# EAGLE design XBee FX I2C Interface v1.4 (EAGLE 6.4)
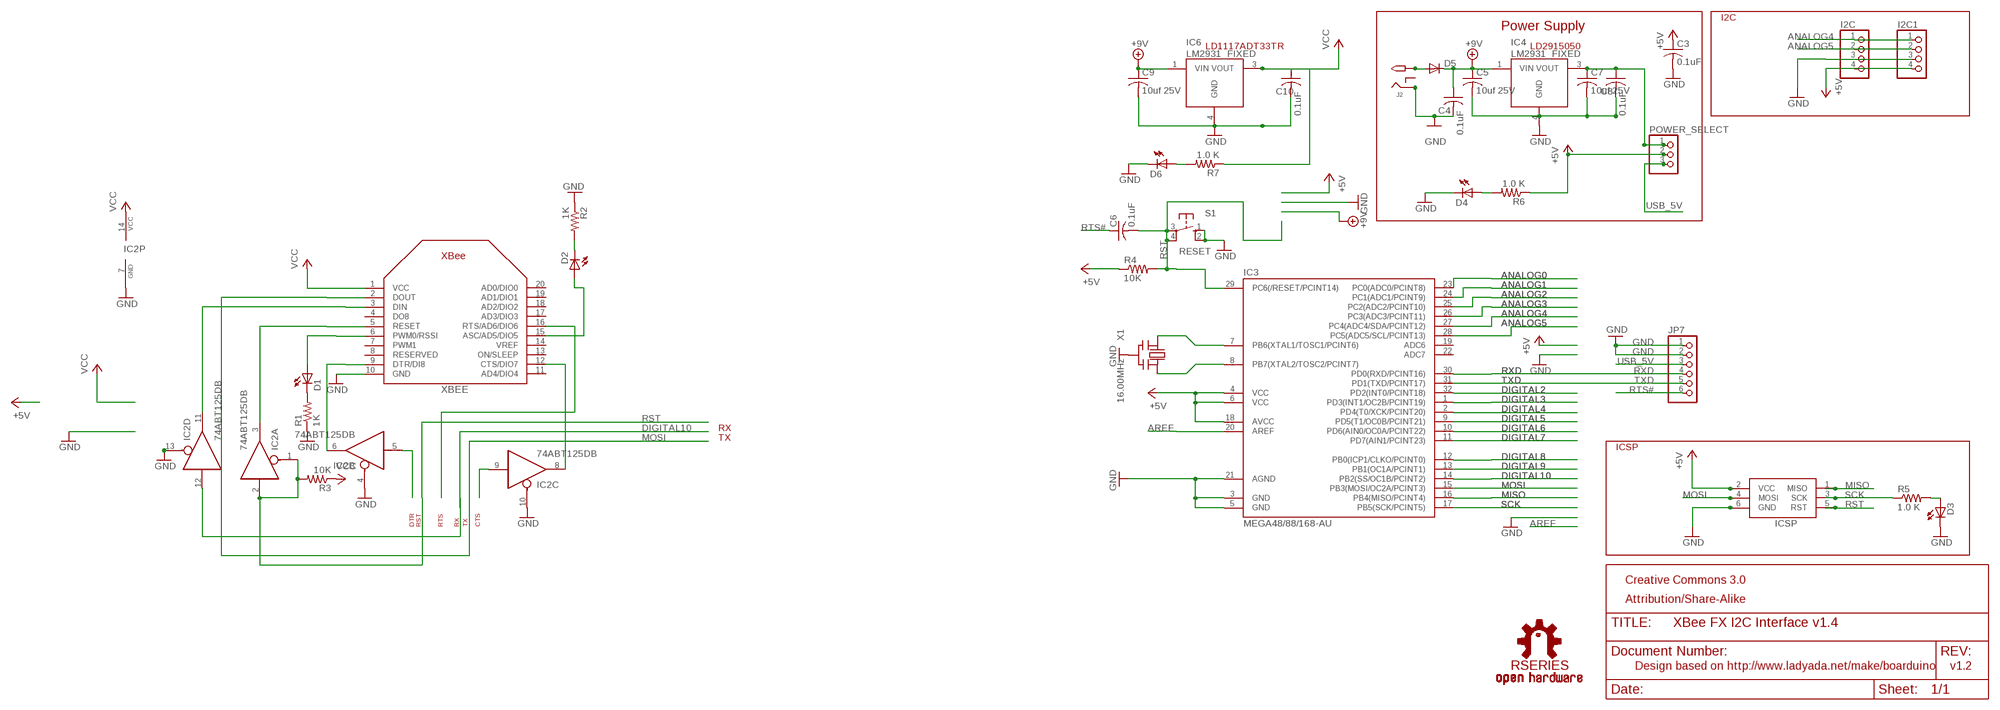
[diagram p0: schematic, sheet 1]

## Parts
C3  0.1uF  C-USC1206K  [C1206K]
C4  0.1uF  C-USC1206K  [C1206K]
C5  10uf 25V  C-USC1206K  [C1206K]
C6  0.1uF  C-USC1206K  [C1206K]
C7  10uf 25V  C-USC1206K  [C1206K]
C8  0.1uF  C-USC1206K  [C1206K]
C9  10uf 25V  C-USC1206K  [C1206K]
C10  0.1uF  C-USC1206K  [C1206K]
D1  LEDCHIPLED_1206  [CHIPLED_1206]
D2  LEDCHIPLED_1206  [CHIPLED_1206]
D3  RED  LEDCHIPLED_1206  [CHIPLED_1206]
D4  LEDCHIPLED_1206  [CHIPLED_1206]
D5  DIODE-SMB  [SMB]
D6  LEDCHIPLED_1206  [CHIPLED_1206]
I2C  PINHD-1X4CB  [1X04-CB]
I2C1  PINHD-1X4CB  [1X04-CB]
IC2  74ABT125DB  [SSOP14]
IC3  MEGA48/88/168-AU  [TQFP32-08]
IC4  LM2931_FIXED  [DPAK]
IC6  LM2931_FIXED  [DPAK]
ICSP  AVRISP-6  [AVRISP]
J2  2.1MMJACK  [PJ-102A]
JP7  PINHD-1X6CLEAN  [1X06-CLEAN]
POWER_SELECT  PINHD-1X3  [1X03]
R1  1K  R-US_R1206  [R1206]
R2  1K  R-US_R1206  [R1206]
R3  10K  R-US_R1206  [R1206]
R4  10K  R-US_R1206  [R1206]
R5  1.0 K  R-US_M1206  [M1206]
R6  1.0 K  R-US_M1206  [M1206]
R7  1.0 K  R-US_M1206  [M1206]
S1  RESET  10-XX  [B3F-10XX]
U$6  RSERIES-OSHW-LOGOMEDIUM  [RSERIES-OSHW-LOGO-MEDIUM]
X1  16.00MHz  CERMOSCILL  [CERM_OSC]
XBEE  XBEE  [XBEE]

## Nets
+5V [supply]: C3.1 I2C1.4 I2C.4 IC3.4(VCC) IC3.6(VCC) IC3.18(AVCC) ICSP.2(VCC) POWER_SELECT.2 R4.1 R6.1
+9V [supply]: C4.1 C5.1 C9.1 D5.C IC4.1(VIN) IC6.1(VIN)
ANALOG0: IC3.23(PC0(ADC0/PCINT8))
ANALOG1: IC3.24(PC1(ADC1/PCINT9))
ANALOG2: IC3.25(PC2(ADC2/PCINT10))
ANALOG3: IC3.26(PC3(ADC3/PCINT11))
ANALOG4: I2C1.1 I2C.1 IC3.27(PC4(ADC4/SDA/PCINT12))
ANALOG5: I2C1.2 I2C.2 IC3.28(PC5(ADC5/SCL/PCINT13))
AREF: IC3.20(AREF)
DIGITAL2: IC3.32(PD2(INT0/PCINT18))
DIGITAL3: IC3.1(PD3(INT1/OC2B/PCINT19))
DIGITAL4: IC3.2(PD4(T0/XCK/PCINT20))
DIGITAL5: IC3.9(PD5(T1/OC0B/PCINT21))
DIGITAL6: IC3.10(PD6(AIN0/OC0A/PCINT22))
DIGITAL7: IC3.11(PD7(AIN1/PCINT23))
DIGITAL8: IC3.12(PB0(ICP1/CLKO/PCINT0))
DIGITAL9: IC3.13(PB1(OC1A/PCINT1))
DIGITAL10: IC2.12(D:I) IC3.14(PB2(SS/OC1B/PCINT2))
GND [GND]: C3.2 C4.2 C9.2 C10.2 D3.C D4.C D6.C I2C1.3 I2C.3 IC2.4(B:OE) IC2.7(P:GND) IC2.10(C:OE) IC2.13(D:OE) IC3.3(GND) IC3.5(GND) IC3.21(AGND) IC4.4(GND) IC6.4(GND) ICSP.6(GND) J2.RING JP7.1 JP7.2 R1.1 R2.1 S1.1(S) S1.2(S1) X1.P$2(GND) XBEE.10(GND)
MISO: IC3.16(PB4(MISO/PCINT4)) ICSP.1(MISO)
MOSI: IC3.15(PB3(MOSI/OC2A/PCINT3)) ICSP.4(MOSI) XBEE.2(DOUT)
N$2: IC2.11(D:O) XBEE.3(DIN)
N$3: IC2.5(B:I)
N$5: D2.C R2.2
N$6: D6.A R7.2
N$7: D1.A XBEE.6(PWM0/RSSI)
N$8: D1.C R1.2
N$10: IC2.6(B:O) XBEE.9(DTR/DI8)
N$13: IC2.3(A:O) XBEE.5(RESET)
N$21: IC2.9(C:I)
N$22: IC2.8(C:O) XBEE.12(CTS/DIO7)
N$23: D2.A XBEE.15(ASC/AD5/DIO5)
N$25: IC3.7(PB6(XTAL1/TOSC1/PCINT6)) X1.P$1(IN)
N$26: IC3.8(PB7(XTAL2/TOSC2/PCINT7)) X1.P$3(OUT)
N$27: D3.A R5.2
N$28 [supply]: D4.A R6.2
N$29 [supply]: D5.A J2.TIP
N$30: C5.2 C7.2 C8.2
N$31 [supply]: C7.1 C8.1 IC4.3(VOUT) POWER_SELECT.1
RST: C6.2 IC2.1(A:OE) IC2.2(A:I) IC3.29(PC6(/RESET/PCINT14)) ICSP.5(RST) R3.2 R4.2 S1.3(P) S1.4(P1)
RTS: XBEE.16(RTS/AD6/DIO6)
RTS#: C6.1 JP7.6
RXD: IC3.30(PD0(RXD/PCINT16)) JP7.4
SCK: IC3.17(PB5(SCK/PCINT5)) ICSP.3(SCK) R5.1
TXD: IC3.31(PD1(TXD/PCINT17)) JP7.5
USB_5V [supply]: JP7.3 POWER_SELECT.3
VCC [supply]: C10.1 IC2.14(P:VCC) IC6.3(VOUT) R3.1 R7.1 XBEE.1(VCC)
Unconnected: IC3.19(ADC6) IC3.22(ADC7) J2.RING_SW XBEE.4(DO8) XBEE.7(PWM1) XBEE.8(RESERVED) XBEE.11(AD4/DIO4) XBEE.13(ON/SLEEP) XBEE.14(VREF) XBEE.17(AD3/DIO3) XBEE.18(AD2/DIO2) XBEE.19(AD1/DIO1) XBEE.20(AD0/DIO0)

## Notes on the sheet
- I2C
- Power Supply
- LD1117ADT33TR | LD2915050
- RX
- TX
- ICSP
- DTR | RST | RTS | RX | TX | CTS
- Creative Commons 3.0
- Attribution/Share-Alike
- Design based on http://www.ladyada.net/make/boarduino | v1.2

## Library data of the parts
C3 C4 C6 C8 C10 = minimidi:C-US: CAPACITOR, American symbol
C5 C7 C9 = rcl:C-US: CAPACITOR, American symbol
D1-D4 D6 = minimidi:LED: LED OSRAM: - CHIPLED LG R971, LG N971, LY N971, LG Q971, LY Q971, LO R971, LY R971 LH N974, LH R974 LS Q976, LO Q976, LY Q976 LO Q996 - Hyper CHIPLED LW Q18S LB Q993, LB Q99A, LB R99A - SideLED LS A670, LO A670, LY A670, LG A670, LP A670 LB A673, LV A673, LT A673, LW A673 LH A674 LY A675 LS A676, LA A676, LO A676, LY A676, LW A676 LS A679, LY A679, LG A679 - Hyper Micro SIDELED® LS Y876, LA Y876, LO Y876, LY Y876 LT Y87S - SmartLED LW L88C, LW L88S LB L89C, LB L89S, LG L890 LS L89K, LO L89K, LY L89K LS L896, LA L896, LO L896, LY L896 - TOPLED LS T670, LO T670, LY T670, LG T670, LP T670 LSG T670, LSP T670, LSY T670, LOP T670, LYG T670 LG T671, LOG T671, LSG T671 LB T673, LV T673, LT T673, LW T673 LH T674 LS T676, LA T676, LO T676, LY T676, LB T676, LH T676, LSB T676, LW T676 LB T67C, LV T67C, LT T67C, LS T67K, LO T67K, LY T67K, LW E67C LS E67B, LA E67B, LO E67B, LY E67B, LB E67C, LV E67C, LT E67C LW T67C LS T679, LY T679, LG T679 LS T770, LO T770, LY T770, LG T770, LP T770 LB T773, LV T773, LT T773, LW T773 LH T774 LS E675, LA E675, LY E675, LS T675 LS T776, LA T776, LO T776, LY T776, LB T776 LHGB T686 LT T68C, LB T68C - Hyper Mini TOPLED® LB M676 - Mini TOPLED Santana® LG M470 LS M47K, LO M47K, LY M47K Source: http://www.osram.convergy.de/
D5 = diode:DIODE-: DIODE
I2C I2C1 = carduino:PINHD-1X4: PIN HEADER
IC2 = 74xx-us:74*125: Quad bus BUFFER, 3-state
IC3 = avr-7:MEGA48/88/168
IC4 IC6 = SparkFun-PowerIC:LM2931_FIXED: LDO regulator with reverse battery protection- very durable!
ICSP = adafruit:AVRISP: AVR ISP HEADER Standard 6 pin header for AVR programming
J2 = minimidi:2.1MMJACK
JP7 = carduino:PINHD-1X6: PIN HEADER
POWER_SELECT = pinhead:PINHD-1X3: PIN HEADER
R1-R4 = rcl-ez:R-US_: RESISTOR, American symbol
R5-R7 = minimidi:R-US_: RESISTOR, American symbol
S1 = switch-omron:10-XX: OMRON SWITCH
U$6 = rseries:RSERIES-OSHW-LOGO
X1 = digg:CERMOSCILL
XBEE = ulink:XBEE

## Net classes
1 supply: width 0.381 mm, drill 0.152 mm, clearance 0.152 mm
2 GND: width 0.381 mm, drill 0.305 mm, clearance 0.152 mm

## Board
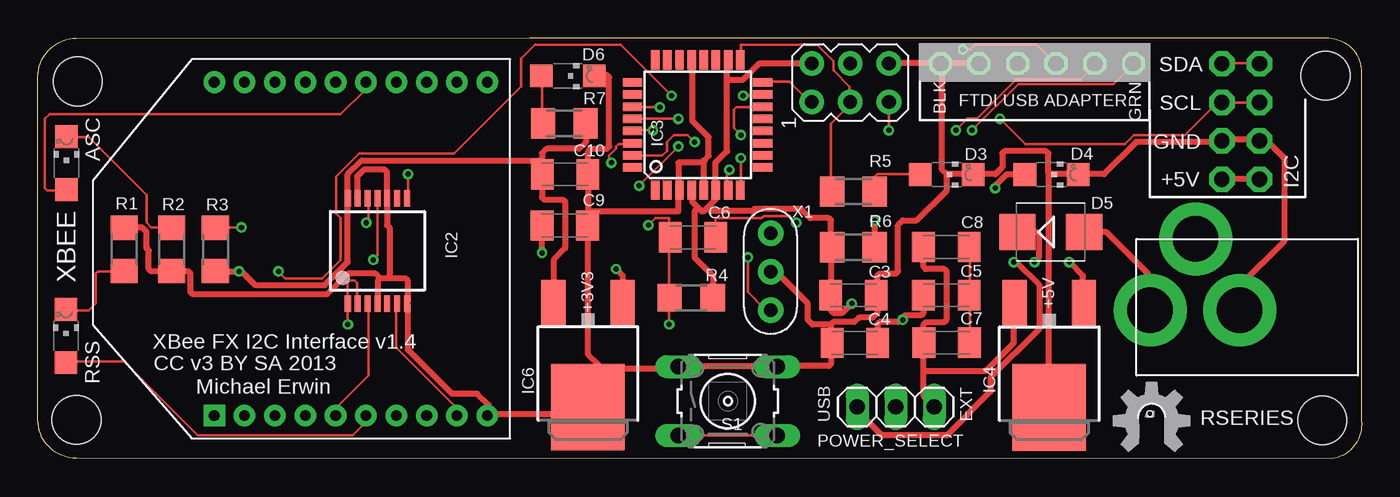
[diagram p1: board, top side]
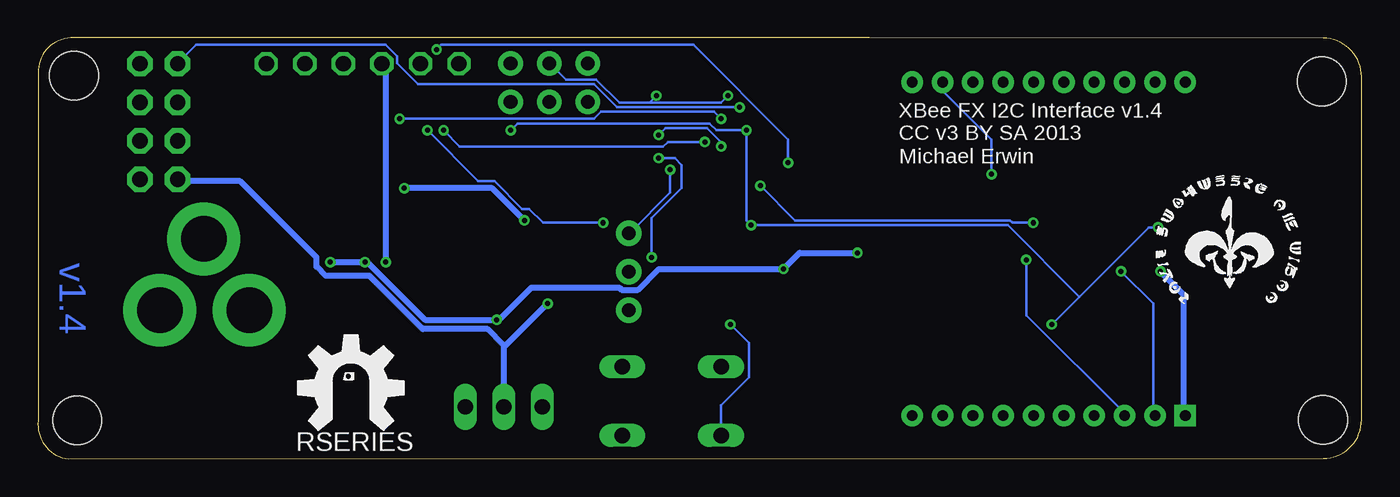
[diagram p2: board, bottom side, seen from below]

Size 87.24 x 27.76 mm. Coordinates in mm from the lower left corner, seen from the top.
Outline: 32.44,27.76 85.06,27.76 arc-90 87.22,25.45 87.22,2.51 arc-90 85.22,0 2.54,0.03 arc-90 0,2.57 0,25.2 arc-90 2.54,27.74 32.44,27.76
Copper layers (1*16): Top 0.0356mm / dielectric 1.5011mm / Bottom 0.0356mm
Design rules "LaenPCBOrder": minimum track width 6mil, minimum drill 13mil, track to track 6mil, track to pad 6mil, pad to pad 6mil, via to via 12mil, smd to smd 6mil, copper to edge 15mil, drill to drill 6mil, minimum pad ring 7mil, minimum via ring 7mil, stop-mask expansion 4mil, vias tented up to drill 0mil, thermal gap 10mil
Holes 3.2 mm at 2.54,2.57 2.62,24.89 84.86,25.27 84.66,2.54

### Footprints (pad centres in the part's own frame; a part is rotated, then mirrored left to right if it is on the bottom)
C1206K = smd 1.5 x 2: 1 -1.5,0; 2 1.5,0
CHIPLED_1206 = smd 1.5 x 1.5: A 0,-1.75; C 0,1.75
SMB = smd 2.4 x 2.4: A 2.2,0; C -2.2,0
1X04-CB = drill 1.016 pad 1.676 octagon: 1 -3.81,0; 2 -1.27,0; 3 1.27,0; 4 3.81,0
SSOP14 = smd 0.4 x 1.1: 1 -1.95,-3.475; 2 -1.3,-3.475; 3 -0.65,-3.475; 4 0,-3.475; 5 0.65,-3.475; 6 1.3,-3.475; 7 1.95,-3.475; 8 1.95,3.475; 9 1.3,3.475; 10 0.65,3.475; 11 0,3.475; 12 -0.65,3.475; 13 -1.3,3.475; 14 -1.95,3.475
TQFP32-08 = smd 1.27 x 0.559: 1 -4.293,2.8; 2 -4.293,2; 3 -4.293,1.2; 4 -4.293,0.4; 5 -4.293,-0.4; 6 -4.293,-1.2; 7 -4.293,-2; 8 -4.293,-2.8; 17 4.293,-2.8; 18 4.293,-2; 19 4.293,-1.2; 20 4.293,-0.4; 21 4.293,0.4; 22 4.293,1.2; 23 4.293,2; 24 4.293,2.8 | smd 0.559 x 1.27: 9 -2.8,-4.293; 10 -2,-4.293; 11 -1.2,-4.293; 12 -0.4,-4.293; 13 0.4,-4.293; 14 1.2,-4.293; 15 2,-4.293; 16 2.8,-4.293; 25 2.8,4.293; 26 2,4.293; 27 1.2,4.293; 28 0.4,4.293; 29 -0.4,4.293; 30 -1.2,4.293; 31 -2,4.293; 32 -2.8,4.293
DPAK = smd 1.6 x 3: 1 -2.28,-5.31; 3 2.28,-5.31 | smd 4.826 x 5.715: 4 0,1.588
AVRISP = drill 0.9 pad 1.626: 1 -1.27,2.54; 2 1.27,2.54; 3 -1.27,0; 4 1.27,0; 5 -1.27,-2.54; 6 1.27,-2.54
PJ-102A = drill 3 pad 4.8: RING 0.1,-3.39; RING_SW -4.6,-6.29; TIP 0.1,-9.29
1X06-CLEAN = drill 1.016 octagon: 1 -6.35,0; 2 -3.81,0; 3 -1.27,0; 4 1.27,0; 5 3.81,0; 6 6.35,0
1X03 = drill 1.016 long: 1 -2.54,0; 2 0,0; 3 2.54,0
R1206 = smd 1.6 x 1.803: 1 -1.422,0; 2 1.422,0
M1206 = smd 1.6 x 2: 1 -1.4,0; 2 1.4,0
B3F-10XX = drill 1.016 long: 1 -3.251,2.261; 2 3.251,2.261; 3 -3.251,-2.261; 4 3.251,-2.261
CERM_OSC = drill 0.9 pad 1.676: P$1 -2.54,0; P$2 0,0; P$3 2.54,0
XBEE = drill 0.7 pad 1.422 square: 1 -11,5.5 | drill 0.7 pad 1.422: 2 -11,3.5; 3 -11,1.5; 4 -11,-0.5; 5 -11,-2.5; 6 -11,-4.5; 7 -11,-6.5; 8 -11,-8.5; 9 -11,-10.5; 10 -11,-12.5; 11 11,-12.5; 12 11,-10.5; 13 11,-8.5; 14 11,-6.5; 15 11,-4.5; 16 11,-2.5; 17 11,-0.5; 18 11,1.5; 19 11,3.5; 20 11,5.5

### Placement (x,y rotation side)
C3  53.75,10.79 0 top
C4  53.85,7.65 180 top
C5  59.87,10.79 0 top
C6  43.18,14.6 180 top
C7  59.89,7.67 0 top
C8  59.87,13.97 0 top
C9  34.72,15.39 0 top
C10  34.75,18.77 0 top
D1  1.85,8.1 0 top
D2  1.88,19.51 0 top
D3  59.89,18.75 270 top
D4  66.8,18.75 270 top
D5  66.75,14.96 0 top
D6  34.92,25.25 270 top
I2C  78.03,22.25 270 top
I2C1  80.52,22.25 270 top
IC2  22.38,13.72 0 top
IC3  43.48,22.02 90 top
IC4  66.65,4.98 180 top
IC6  36.25,5 180 top
ICSP  53.54,24.82 90 top
J2  82.6,9.91 270 top
JP7  65.84,26.06 0 top
POWER_SELECT  56.54,3.43 180 top
R1  5.69,13.82 270 top
R2  8.81,13.82 90 top
R3  11.71,13.82 90 top
R4  43.05,10.62 180 top
R5  53.75,17.63 0 top
R6  53.75,13.94 0 top
R7  34.7,22.12 180 top
S1  45.47,3.81 0 top
U$2  [RSERIES-OSHW-LOGO-LARGE]  66.6,4.67 0 bottom
U$5  [ROYAL-ENGINEERS-OF-NABOO-SMALL]  13.64,9.93 0 bottom
U$6  73.3,2.57 0 top
X1  48.29,12.34 270 top
XBEE  17.12,13.84 90 top

### Tracks (layer width: path | path; a pad name or v marks a point on that pad's centre or on a via)
+5V  (via drill 0.33)
  Top 0.381: 43.51,16.56 43.74,16.33 43.89,16.33 44.12,16.56 | 43.51,16.56 43.13,16.94 43.13,17.7 IC3.4 | 44.12,16.56 44.65,17.09 44.65,17.7 IC3.6 44.65,17.86 44.65,19.53 45.41,20.29 45.41,25.02 | 45.41,25.02 45.41,26.24 IC3.18 | R4.1 44.5,10.69 44.5,12.07 43.28,13.28 43.28,16.33 43.43,16.48 43.51,16.56 | ICSP.2 50.9,26.09 47.55,26.09 46.48,25.02 45.57,25.02 45.41,25.02 | I2C.4 78.03,18.47 80.47,18.47 I2C1.4 | v53.65,10.24 53.03,9.63 52.43,9.63 52.27,9.78 52.27,10.69 C3.1 52.27,10.85 52.27,13.89 R6.1 52.27,14.05 52.27,15.72 52.12,15.88 50.9,15.88 50.29,16.48 47.24,16.48 47.09,16.33 44.35,16.33 44.2,16.48 44.12,16.56
  Bottom 0.381: 56.54,7.34 56.54,3.53 POWER_SELECT.2 | v53.65,10.24 56.54,7.34 | I2C.4 78.03,18.31 73.91,18.31 68.89,13.28 68.89,12.67 68.28,12.07 65.38,12.07 61.87,8.56 57.61,8.56 56.54,7.49 56.54,7.34
+9V  (via drill 0.33)
  Top 0.381: v33.22,13.59 33.22,15.27 C9.1 | v38.1,12.52 38.56,12.07 38.56,10.39 IC6.1 | 56.92,9.25 57.15,9.47 58.22,9.47 58.37,9.63 58.37,10.69 C5.1 | 56.92,9.25 56.69,9.02 55.47,9.02 55.32,8.86 55.32,7.65 C4.1 | v65.68,12.98 65.99,13.28 65.99,14.81 65.84,14.96 64.62,14.96 D5.C | v67.97,12.98 68.89,12.07 68.89,10.39 IC4.1 | v57,9.17 56.92,9.25
  Bottom 0.381: v33.22,13.59 37.03,13.59 v38.1,12.52 38.25,12.52 46.33,12.52 47.7,11.15 48.77,11.15 48.92,11.3 54.71,11.3 56.84,9.17 v57,9.17 61.72,9.17 65.53,12.98 v65.68,12.98 v67.97,12.98
ANALOG4  (via drill 0.33)
  Top 0.152: v41,23.19 39.32,23.19 IC3.27 | I2C1.1 80.47,26.09 78.03,26.09 I2C.1
  Bottom 0.152: v41,23.19 49.07,23.19 50.6,24.71 62.18,24.71 63.55,26.09 63.55,26.54 64.31,27.31 76.81,27.31 78.03,26.09 I2C.1
ANALOG5  (via drill 0.33)
  Top 0.152: v42.22,22.43 39.32,22.43 IC3.28 | v63.4,22.43 65.08,20.75 71.63,20.75 72.24,21.36 75.59,21.36 77.72,23.5 78.03,23.5 | 78.03,23.5 I2C.2 78.03,23.5 | 78.03,23.5 80.47,23.5 I2C1.2
  Bottom 0.152: v42.22,22.43 42.67,22.89 50.14,22.89 50.6,22.43 v63.4,22.43
DIGITAL10  (via drill 0.33)
  Top 0.152: v21.64,15.57 21.79,15.72 21.79,17.09 IC2.12 | v42.22,20.6 v39.62,18.01 | v46.33,21.36 45.87,21.82 45.87,23.04 46.02,23.19 47.7,23.19 IC3.14
  Bottom 0.152: v21.64,15.57 23.01,15.57 23.16,15.72 37.34,15.72 v39.62,18.01 | v42.22,20.6 42.22,20.9 43.13,21.82 45.87,21.82 v46.33,21.36
GND
  Top 0.381: JP7.1 59.59,26.09 62.03,26.09 JP7.2 | ICSP.6 59.44,26.09 JP7.1 | 66.6,18.92 66.6,20.14 66.45,20.29 63.7,20.29 63.55,20.14 63.55,19.23 63.09,18.77 61.72,18.77 D3.C 61.57,18.77 59.89,18.77 | 66.6,18.92 66.75,18.77 68.43,18.77 D4.C 68.73,18.77 70.26,18.77 72.39,20.9 77.88,20.9 I2C.3 78.03,21.06 80.47,21.06 I2C1.3 80.62,20.9 81.08,20.9 82.14,19.84 82.14,14.35 79.25,11.46 79.25,9.93 J2.RING | 59.89,18.77 59.59,19.08 59.59,25.93 JP7.1 | IC4.4 66.6,3.53 66.6,18.77 66.6,18.92 | R1.1 5.79,15.27 6.86,15.27 7.16,14.96 7.16,13.89 7.32,13.74 7.32,12.52 7.47,12.37 8.69,12.37 R2.1 8.99,12.37 9.91,12.37 10.06,12.22 10.06,11 10.21,10.85 19.05,10.85 20.42,12.22 22.25,12.22 22.55,11.91 | 22.55,11.91 22.4,11.76 22.4,10.39 IC2.4 | 23.16,11.91 24.23,11.91 24.38,11.76 24.38,10.39 IC2.7 24.38,10.08 24.38,7.19 27.28,4.29 28.96,4.29 29.72,3.53 29.72,3.07 XBEE.10 29.72,2.92 36.27,2.92 36.27,3.38 IC6.4 | 23.16,11.91 22.55,11.91 | IC2.13 21.03,17.25 21.03,18.62 21.49,19.08 22.86,19.08 23.01,18.92 23.01,17.25 IC2.10 23.01,17.09 23.01,15.42 23.16,15.27 23.16,12.07 23.16,11.91 | IC3.3 42.37,17.7 IC3.3 | 43.89,19.53 42.22,19.53 42.22,17.86 IC3.3 | 43.89,19.53 43.89,17.86 IC3.5 | IC3.5 43.89,17.7 IC3.5 | IC3.21 43.13,26.24 43.13,22.28 44.2,21.21 44.2,19.99 43.89,19.69 43.89,19.53 | D6.C 36.73,25.32 37.49,25.32 37.64,25.17 37.64,20.6 37.49,20.45 36.42,20.45 36.27,20.29 36.27,18.77 C10.2 36.27,18.62 36.27,15.42 C9.2 | IC3.3 42.22,17.55 42.22,16.33 36.42,16.33 C9.2 | 52.27,8.86 52.27,7.65 C4.2 52.27,7.49 52.27,6.27 52.12,6.12 48.77,6.12 S1.2 48.62,6.12 42.37,6.12 S1.1 42.22,5.97 37.03,5.97 36.27,5.21 36.27,3.53 IC6.4
  Top 0.381: 52.27,8.86 52.43,9.02 53.8,9.02 54.1,9.32 55.02,9.32 55.32,9.63 55.32,10.69 C3.2 55.32,10.85 55.32,12.07 55.47,12.22 56.54,12.22 56.69,12.37 56.69,15.42 57,15.72 57.91,15.72 59.89,17.7 59.89,18.62 59.89,18.77 | X1.P$2 48.31,12.22 48.77,12.22 50.75,10.24 50.75,9.17 51.05,8.86 52.12,8.86 52.27,8.86 | C9.2 36.27,15.27 36.27,6.88 37.03,6.12 IC6.4
MISO
  Top 0.152: IC3.16 47.85,24.87 49.53,24.87 50.9,23.5 ICSP.1
MOSI  (via drill 0.33)
  Top 0.152: v46.48,23.95 47.7,23.95 IC3.15 | v15.85,12.37 16.31,11.91 18.75,11.91 19.96,13.13 19.96,15.88 19.66,16.18 19.66,18.62 21.18,20.14 27.43,20.14 31.85,24.56 31.85,26.39 32.77,27.31 38.41,27.31 v41.76,23.95
  Bottom 0.152: 46.94,23.5 v46.48,23.95 | 46.94,23.5 48.92,23.5 50.44,25.02 52.43,25.02 53.49,26.09 ICSP.4 | v15.85,12.37 13.72,10.24 13.72,2.92 XBEE.2 | v41.76,23.95 42.22,23.5 46.94,23.5
N$2  (via drill 0.33)
  Top 0.152: v22.1,13.13 22.4,13.44 22.4,17.09 IC2.11
  Bottom 0.152: v22.1,13.13 22.1,9.47 15.54,2.92 XBEE.3
N$5
  Top 0.152: D2.C 1.98,21.21 3.35,21.21 7.16,17.4 7.16,15.57 7.47,15.27 8.69,15.27 R2.2
N$6
  Top 0.152: D6.A 33.22,25.17 33.22,22.12 R7.2
N$7
  Top 0.152: D1.A 1.98,6.43 5.64,6.43 10.52,1.55 20.73,1.55 21.49,2.31 21.49,2.77 XBEE.6
N$8
  Top 0.152: D1.C 1.98,9.78 3.35,9.78 3.81,10.24 3.81,12.22 3.96,12.37 5.64,12.37 R1.2
N$10
  Top 0.152: IC2.6 23.62,10.24 23.62,7.34 27.58,3.38 27.58,2.92 XBEE.9
N$13
  Top 0.152: IC2.3 21.79,10.24 21.79,5.51 19.66,3.38 19.66,2.92 XBEE.5
N$22  (via drill 0.33)
  Top 0.152: v24.38,18.77 24.38,17.25 IC2.8
  Bottom 0.152: v24.38,18.77 24.38,21.06 27.58,24.26 27.58,24.71 XBEE.12
N$23
  Top 0.152: D2.A 1.83,17.7 0.61,17.7 0.46,17.86 0.46,22.43 0.76,22.73 19.96,22.73 21.49,24.26 21.49,24.71 XBEE.15
N$25  (via drill 0.33)
  Top 0.152: v45.57,19.08 45.41,18.92 45.41,17.86 IC3.7
  Bottom 0.152: v45.57,19.08 45.57,17.55 48.16,14.96 X1.P$1
N$26  (via drill 0.33)
  Top 0.152: v46.33,19.84 46.33,17.86 IC3.8 | v46.79,13.28 46.79,11 47.85,9.93 48.16,9.93 X1.P$3
  Bottom 0.152: v46.33,19.84 45.26,19.84 44.81,19.38 44.81,17.86 46.79,15.88 v46.79,13.28
N$27
  Top 0.152: D3.A 58.06,18.77 55.32,18.77 55.17,18.62 55.17,17.7 R5.2
N$28  (via drill 0.33)
  Top 0.381: v63.09,17.86 63.09,18.01 63.86,18.77 64.92,18.77 D4.A | v55.17,15.72 55.17,14.05 R6.2
  Bottom 0.381: v63.09,17.86 57.3,17.86 v55.17,15.72
N$29
  Top 0.381: D5.A 69.04,14.96 70.41,14.96 73.15,12.22 73.15,10.08 73.3,9.93 J2.TIP
N$30
  Top 0.152: C7.2 61.42,7.8 61.42,10.69 C5.2 61.42,10.85 61.42,13.89 C8.2
N$31
  Top 0.381: 58.37,5.82 58.37,4.14 58.98,3.53 POWER_SELECT.1 | 58.37,5.82 58.37,7.65 C7.1 58.37,7.8 58.37,8.86 58.52,9.02 59.74,9.02 59.89,9.17 59.89,12.37 59.74,12.52 58.52,12.52 58.37,12.67 58.37,13.89 C8.1 | IC4.3 64.31,10.24 64.31,7.65 62.48,5.82 58.52,5.82 58.37,5.82
RST  (via drill 0.33)
  Top 0.152: IC2.2 21.03,10.39 21.03,11.61 20.88,11.76 20.57,11.76 20.42,11.61 20.42,10.39 IC2.1 v20.42,8.86 | v13.41,15.27 11.73,15.27 R3.2 | S1.3 48.62,1.55 S1.4 | v40.54,21.67 39.32,21.67 IC3.29 | v40.23,15.42 40.69,15.88 41.6,15.88 41.6,14.66 C6.2 41.6,14.5 41.6,10.69 R4.2 41.6,10.54 v41.6,8.86 | v56.08,21.67 56.08,23.5 ICSP.5
  Bottom 0.152: 18.59,10.69 14.02,15.27 v13.41,15.27 | 18.59,10.69 v20.42,8.86 | v56.08,21.67 55.63,22.12 42.98,22.12 42.52,21.67 v40.54,21.67 40.54,15.72 v40.23,15.42 23.32,15.42 18.59,10.69 | S1.3 42.22,3.53 40.39,5.36 40.39,7.65 v41.6,8.86
RTS#  (via drill 0.33)
  Top 0.152: v49.99,15.57 49.53,16.03 47.85,16.03 47.7,15.88 44.65,15.88 44.65,14.66 C6.1 | v61.57,21.67 64.62,24.71 70.87,24.71 72.08,25.93 JP7.6
  Bottom 0.152: v49.99,15.57 53.95,15.57 54.86,16.48 55.32,16.48 57.15,18.31 58.22,18.31 v61.57,21.67
RXD  (via drill 0.33)
  Top 0.152: v37.8,19.53 37.64,19.69 37.64,19.99 38.1,20.45 38.1,20.6 38.25,20.75 39.17,20.75 IC3.30 | v60.96,27 61.42,27 61.72,27.31 65.84,27.31 67.06,26.09 JP7.4
  Bottom 0.152: v37.8,19.53 37.8,21.06 44.04,27.31 60.66,27.31 v60.96,27
SCK
  Top 0.152: IC3.17 46.33,26.39 46.33,27.31 51.36,27.31 52.43,26.24 52.43,25.63 53.49,24.56 53.49,23.65 ICSP.3 53.65,23.5 52.27,22.12 52.27,17.7 R5.1
TXD  (via drill 0.33)
  Top 0.152: v43.28,20.9 42.82,21.36 41.91,21.36 41.45,20.9 41.45,20.29 41.15,19.99 39.32,19.99 IC3.31 | v60.5,21.67 61.27,22.43 61.87,22.43 64.47,25.02 68.73,25.02 69.65,25.93 JP7.5
  Bottom 0.152: v43.28,20.9 45.72,20.9 46.02,20.6 59.44,20.6 v60.5,21.67
USB_5V  (via drill 0.33)
  Top 0.381: v64.31,12.98 64.47,12.98 65.99,11.46 65.99,8.56 62.79,5.36 62.79,4.45 59.89,1.55 55.63,1.55 54.1,3.07 54.1,3.38 POWER_SELECT.3
  Bottom 0.381: v64.31,12.98 64.31,25.78 64.47,25.93 JP7.3
VCC  (via drill 0.33)
  Top 0.381: C10.1 33.22,18.77 33.22,20.14 33.53,20.45 35.66,20.45 36.12,20.9 36.12,22.12 R7.1 | IC6.3 33.98,10.39 33.98,13.13 34.75,13.89 34.75,16.94 34.59,17.09 33.38,17.09 33.22,17.25 33.22,18.62 C10.1 | 13.41,12.37 14.33,11.46 18.9,11.46 20.42,12.98 20.42,17.09 IC2.14 20.42,17.25 20.42,18.77 21.34,19.69 33.07,19.69 C10.1 | v13.26,12.37 11.73,12.37 R3.1 | v13.26,12.37 13.41,12.37 | v13.26,12.37 13.41,12.37
  Bottom 0.381: v13.26,12.37 11.73,10.85 11.73,2.92 XBEE.1

### Text on the board
Bottom: v1.4
tPlace: SDA | BLK | GRN | FTDI USB ADAPTER | SCL | GND | +5V | I2C | +5V | +3V3 | XBee FX I2C Interface v1.4 | CC v3 BY SA 2013 / Michael Erwin | RSERIES
tNames: ASC | RSS
bNames: XBee FX I2C Interface v1.4 | CC v3 BY SA 2013 / Michael Erwin | RSERIES
_tsilk: USB | EXT